# EAGLE design project_02 (EAGLE 9.6.2)
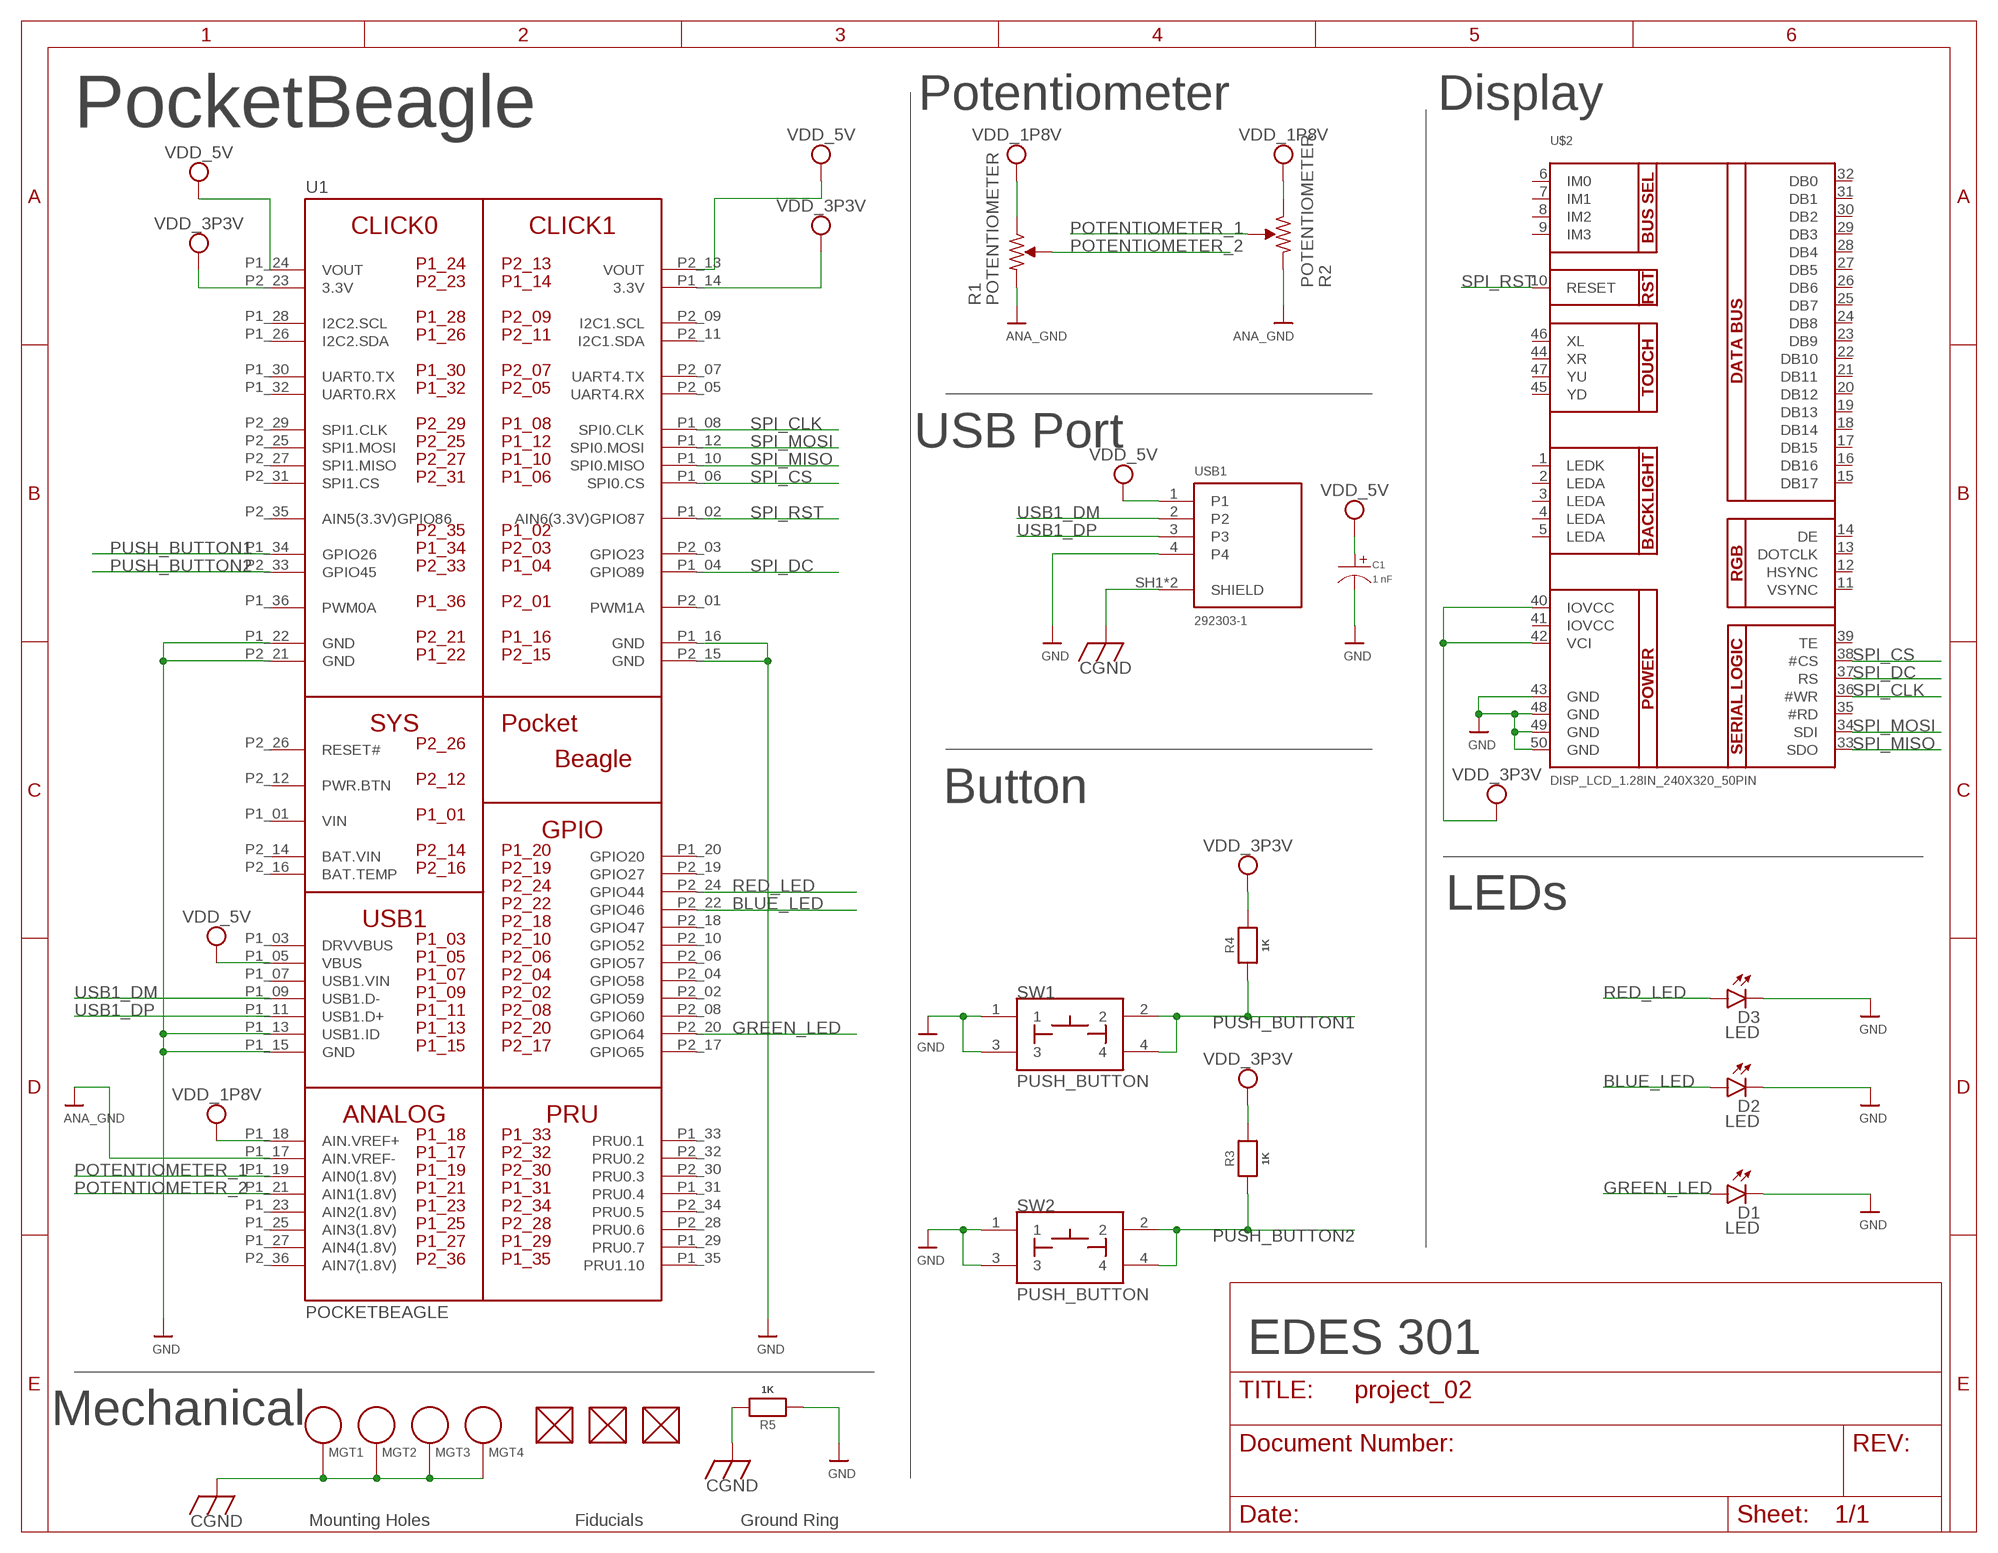
[diagram p0: schematic, sheet 1]

## Parts
C1  1 nF  CAPACITOR_P_4MM  [CP4MM]
D1  LED  LED_13MM  [LED3MM]
D2  LED  LED_13MM  [LED3MM]
D3  LED  LED_13MM  [LED3MM]
FUD2  FIDUCIAL  [FIDUCIAL_40MIL]
FUD3  FIDUCIAL  [FIDUCIAL_40MIL]
FUD4  FIDUCIAL  [FIDUCIAL_40MIL]
MGT1  MOUNTING_HOLE  [MOUNTING_HOLE]
MGT2  MOUNTING_HOLE  [MOUNTING_HOLE]
MGT3  MOUNTING_HOLE  [MOUNTING_HOLE]
MGT4  MOUNTING_HOLE  [MOUNTING_HOLE]
R1  POTENTIOMETER  [POT-PO90S]
R2  POTENTIOMETER  [POT-PO90S]
R3  1K  RESISTOR0603MINI  [0603-MINI]
R4  1K  RESISTOR0603MINI  [0603-MINI]
R5  1K  RESISTOR0603MINI  [0603-MINI]
SW1  PUSH_BUTTON  [BUTTON_12.5MM]
SW2  PUSH_BUTTON  [BUTTON_12.5MM]
U1  POCKETBEAGLE  [POCKETBEAGLE]
U$2  DISP_LCD_1.28IN_240X320_50PIN  [TFT_2.83IN_240X320_50PIN]
USB1  292303-1  [TE_292303-1]

## Nets
BLUE_LED: D2.A U1.P2_22(GPIO46)
CGND: MGT1.P$1 MGT2.P$1 MGT3.P$1 MGT4.P$1 R5.2 USB1.SH1(SHIELD) USB1.SH2(SHIELD)
GND: C1.P$2 D1.K(C) D2.K(C) D3.K(C) R1.CW R2.CW R5.1 SW1.1 SW1.3 SW2.1 SW2.3 U1.P1_13(USB1.ID) U1.P1_15(GND) U1.P1_16(GND) U1.P1_17(AIN.VREF-) U1.P1_22(GND) U1.P2_15(GND) U1.P2_21(GND) U$2.43(GND) U$2.48(GND) U$2.49(GND) U$2.50(GND) USB1.4 ; supply symbol labelled ANA_GND
GREEN_LED: D1.A U1.P2_20(GPIO64)
POTENTIOMETER_1: R2.S U1.P1_19(AIN0(1.8V))
POTENTIOMETER_2: R1.S U1.P1_21(AIN1(1.8V))
PUSH_BUTTON1: R4.1 SW1.2 SW1.4 U1.P1_34(GPIO26)
PUSH_BUTTON2: R3.1 SW2.2 SW2.4 U1.P2_33(GPIO45)
RED_LED: D3.A U1.P2_24(GPIO44)
SPI_CLK: U1.P1_08(SPI0.CLK) U$2.36(#WR)
SPI_CS: U1.P1_06(SPI0.CS) U$2.38(#CS)
SPI_DC: U1.P1_04(GPIO89) U$2.37(RS)
SPI_MISO: U1.P1_10(SPI0.MISO) U$2.33(SDO)
SPI_MOSI: U1.P1_12(SPI0.MOSI) U$2.34(SDI)
SPI_RST: U1.P1_02(AIN6(3.3V)GPIO87) U$2.10(RESET)
USB1_DM: U1.P1_09(USB1.D-) USB1.2
USB1_DP: U1.P1_11(USB1.D+) USB1.3
VDD_1P8V: R1.CCW R2.CCW U1.P1_18(AIN.VREF+)
VDD_3P3V: R3.2 R4.2 U1.P1_14(3.3V) U1.P2_23(3.3V) U$2.40(IOVCC) U$2.42(VCI)
VDD_5V: C1.P$1 U1.P1_05(VBUS) U1.P1_24(VOUT) U1.P2_13(VOUT) USB1.1
Unconnected: FUD2.P$1 FUD3.P$1 FUD4.P$1 U1.P1_03(DRVVBUS) U1.P1_07(USB1.VIN) U1.P1_20(GPIO20) U1.P1_23(AIN2(1.8V)) U1.P1_25(AIN3(1.8V)) U1.P1_26(I2C2.SDA) U1.P1_27(AIN4(1.8V)) U1.P1_28(I2C2.SCL) U1.P1_29(PRU0.7) U1.P1_30(UART0.TX) U1.P1_31(PRU0.4) U1.P1_32(UART0.RX) U1.P1_33(PRU0.1) U1.P1_35(PRU1.10) U1.P1_36(PWM0A) U1.P2_01(PWM1A) U1.P2_02(GPIO59) U1.P2_03(GPIO23) U1.P2_04(GPIO58) U1.P2_05(UART4.RX) U1.P2_06(GPIO57) U1.P2_07(UART4.TX) U1.P2_08(GPIO60) U1.P2_09(I2C1.SCL) U1.P2_10(GPIO52) U1.P2_11(I2C1.SDA) U1.P2_12(PWR.BTN) U1.P2_16(BAT.TEMP) U1.P2_17(GPIO65) U1.P2_18(GPIO47) U1.P2_19(GPIO27) U1.P2_25(SPI1.MOSI) U1.P2_26(RESET#) U1.P2_27(SPI1.MISO) U1.P2_28(PRU0.6) U1.P2_29(SPI1.CLK) U1.P2_30(PRU0.3) U1.P2_31(SPI1.CS) U1.P2_32(PRU0.2) U1.P2_34(PRU0.5) U1.P2_35(AIN5(3.3V)GPIO86) U1.P2_36(AIN7(1.8V)) U$2.1(LEDK) U$2.2(LEDA) U$2.3(LEDA) U$2.4(LEDA) U$2.5(LEDA) U$2.6(IM0) U$2.7(IM1) U$2.8(IM2) U$2.9(IM3) U$2.11(VSYNC) U$2.12(HSYNC) U$2.13(DOTCLK) U$2.14(DE) U$2.15(DB17) U$2.16(DB16) U$2.17(DB15) U$2.18(DB14) U$2.19(DB13) U$2.20(DB12) U$2.21(DB11) U$2.22(DB10) U$2.23(DB9) U$2.24(DB8) U$2.25(DB7) U$2.26(DB6) U$2.27(DB5) U$2.28(DB4) U$2.29(DB3) U$2.30(DB2) U$2.31(DB1) U$2.32(DB0) U$2.35(#RD) U$2.39(TE) U$2.41(IOVCC) U$2.44(XR) U$2.45(YD) U$2.46(XL) U$2.47(YU)

## Notes on the sheet
- Potentiometer | Display
- PocketBeagle
- USB Port
- Button
- LEDs
- EDES 301
- Mechanical
- Mounting Holes | Fiducials | Ground Ring

## Power pins joined to a net without a drawn wire
BAT.VIN: U1.P2_14(BAT.VIN)
VIN: U1.P1_01(VIN)

## Library data of the parts
C1 = MF_Passives:CAPACITOR_P: Library: MF_Passives Description: Device for Polarized Capacitors. Manufacture part number (MPN), Voltage Rating, and Tolerance can be added via Attributes. Check https://factory.macrofab.com/parts for the house parts list.; POPULATE: 1
D1-D3 = Adafruit 2.8 TFT Breakout v2:LED_1: LED OSRAM: - CHIPLED LG R971, LG N971, LY N971, LG Q971, LY Q971, LO R971, LY R971 LH N974, LH R974 LS Q976, LO Q976, LY Q976 LO Q996 - Hyper CHIPLED LW Q18S LB Q993, LB Q99A, LB R99A - SideLED LS A670, LO A670, LY A670, LG A670, LP A670 LB A673, LV A673, LT A673, LW A673 LH A674 LY A675 LS A676, LA A676, LO A676, LY A676, LW A676 LS A679, LY A679, LG A679 - Hyper Micro SIDELED® LS Y876, LA Y876, LO Y876, LY Y876 LT Y87S - SmartLED LW L88C, LW L88S LB L89C, LB L89S, LG L890 LS L89K, LO L89K, LY L89K LS L896, LA L896, LO L896, LY L896 - TOPLED LS T670, LO T670, LY T670, LG T670, LP T670 LSG T670, LSP T670, LSY T670, LOP T670, LYG T670 LG T671, LOG T671, LSG T671 LB T673, LV T673, LT T673, LW T673 LH T674 LS T676, LA T676, LO T676, LY T676, LB T676, LH T676, LSB T676, LW T676 LB T67C, LV T67C, LT T67C, LS T67K, LO T67K, LY T67K, LW E67C LS E67B, LA E67B, LO E67B, LY E67B, LB E67C, LV E67C, LT E67C LW T67C LS T679, LY T679, LG T679 LS T770, LO T770, LY T770, LG T770, LP T770 LB T773, LV T773, LT T773, LW T773 LH T774 LS E675, LA E675, LY E675, LS T675 LS T776, LA T776, LO T776, LY T776, LB T776 LHGB T686 LT T68C, LB T68C - Hyper Mini TOPLED® LB M676 - Mini TOPLED Santana® LG M470 LS M47K, LO M47K, LY M47K Source: http://www.osram.convergy.de LUXEON: - LUMILED® LXK2-PW12-R00, LXK2-PW12-S00, LXK2-PW14-U00, LXK2-PW14-V00 LXK2-PM12-R00, LXK2-PM12-S00, LXK2-PM14-U00 LXK2-PE12-Q00, LXK2-PE12-R00, LXK2-PE12-S00, LXK2-PE14-T00, LXK2-PE14-U00 LXK2-PB12-K00, LXK2-PB12-L00, LXK2-PB12-M00, LXK2-PB14-N00, LXK2-PB14-P00, LXK2-PB14-Q00 LXK2-PR12-L00, LXK2-PR12-M00, LXK2-PR14-Q00, LXK2-PR14-R00 LXK2-PD12-Q00, LXK2-PD12-R00, LXK2-PD12-S00 LXK2-PH12-R00, LXK2-PH12-S00 LXK2-PL12-P00, LXK2-PL12-Q00, LXK2-PL12-R00 Source: www.luxeon.com KINGBRIGHT: KA-3528ASYC Source: www.kingbright.com
FUD2-FUD4 = MISC:FIDUCIAL
MGT1-MGT4 = MISC:MOUNTING_HOLE: Chassis Mounting Hole w/GND connection ability
R1 R2 = Adafruit 2.8 TFT Breakout v2:POTENTIOMETER: Potentiometer - Examples: P090S-14T20BR10K (987-1277-ND)
R3-R5 = Adafruit 2.8 TFT Breakout v2:RESISTOR: Resistors For new designs, use the packages preceded by an '_' character since they are more reliable: The following footprints should be used on most boards: _0402 - Standard footprint for regular board layouts _0603 - Standard footprint for regular board layouts _0805 - Standard footprint for regular board layouts _1206 - Standard footprint for regular board layouts For extremely tight-pitch boards where space is at a premium, the following 'micro-pitch' footprints can be used (smaller pads, no silkscreen outline, etc.): _0402MP - Micro-pitch footprint for very dense/compact boards _0603MP - Micro-pitch footprint for very dense/compact boards _0805MP - Micro-pitch footprint for very dense/compact boards _1206MP - Micro-pitch footprint for very dense/compact boards
SW1 SW2 = Adafruit 2.8 TFT Breakout v2:PUSH_BUTTON
U1 = Adafruit 2.8 TFT Breakout v2:POCKETBEAGLE
U$2 = Adafruit 2.8 TFT Breakout v2:DISP_LCD_1.28IN_240X320_50PIN
USB1 = 292303-1:292303-1: Check availability <https://pricing.snapeda.com/parts/292303-1/TE%20Connectivity/view-part?ref=eda>; AVAILABILITY: In Stock; CENTERLINE_PITCH: 2 mm[.078 in]; CHECK_PRICES: https://www.snapeda.com/parts/292303-1/TE+Connectivity+AMP+Connectors/view-part/?ref=eda; COMMENT: 292303-1; DESCRIPTION: Type A Standard USB Connector 4 Position Right Angle Mount 1 Port | TE Connectivity 292303-1; EU_ROHS_COMPLIANCE: Compliant; MF: TE Connectivity; MP: 292303-1; NUMBER_OF_POSITIONS: 4; PACKAGE: None; PRICE: None; PRODUCT_TYPE: Connector; PURCHASE-URL: https://www.snapeda.com/api/url_track_click_mouser/?unipart_id=447501&manufacturer=TE Connectivity&part_name=292303-1&search_term=292303-1; SNAPEDA_LINK: https://www.snapeda.com/parts/292303-1/TE+Connectivity+AMP+Connectors/view-part/?ref=snap

## Board
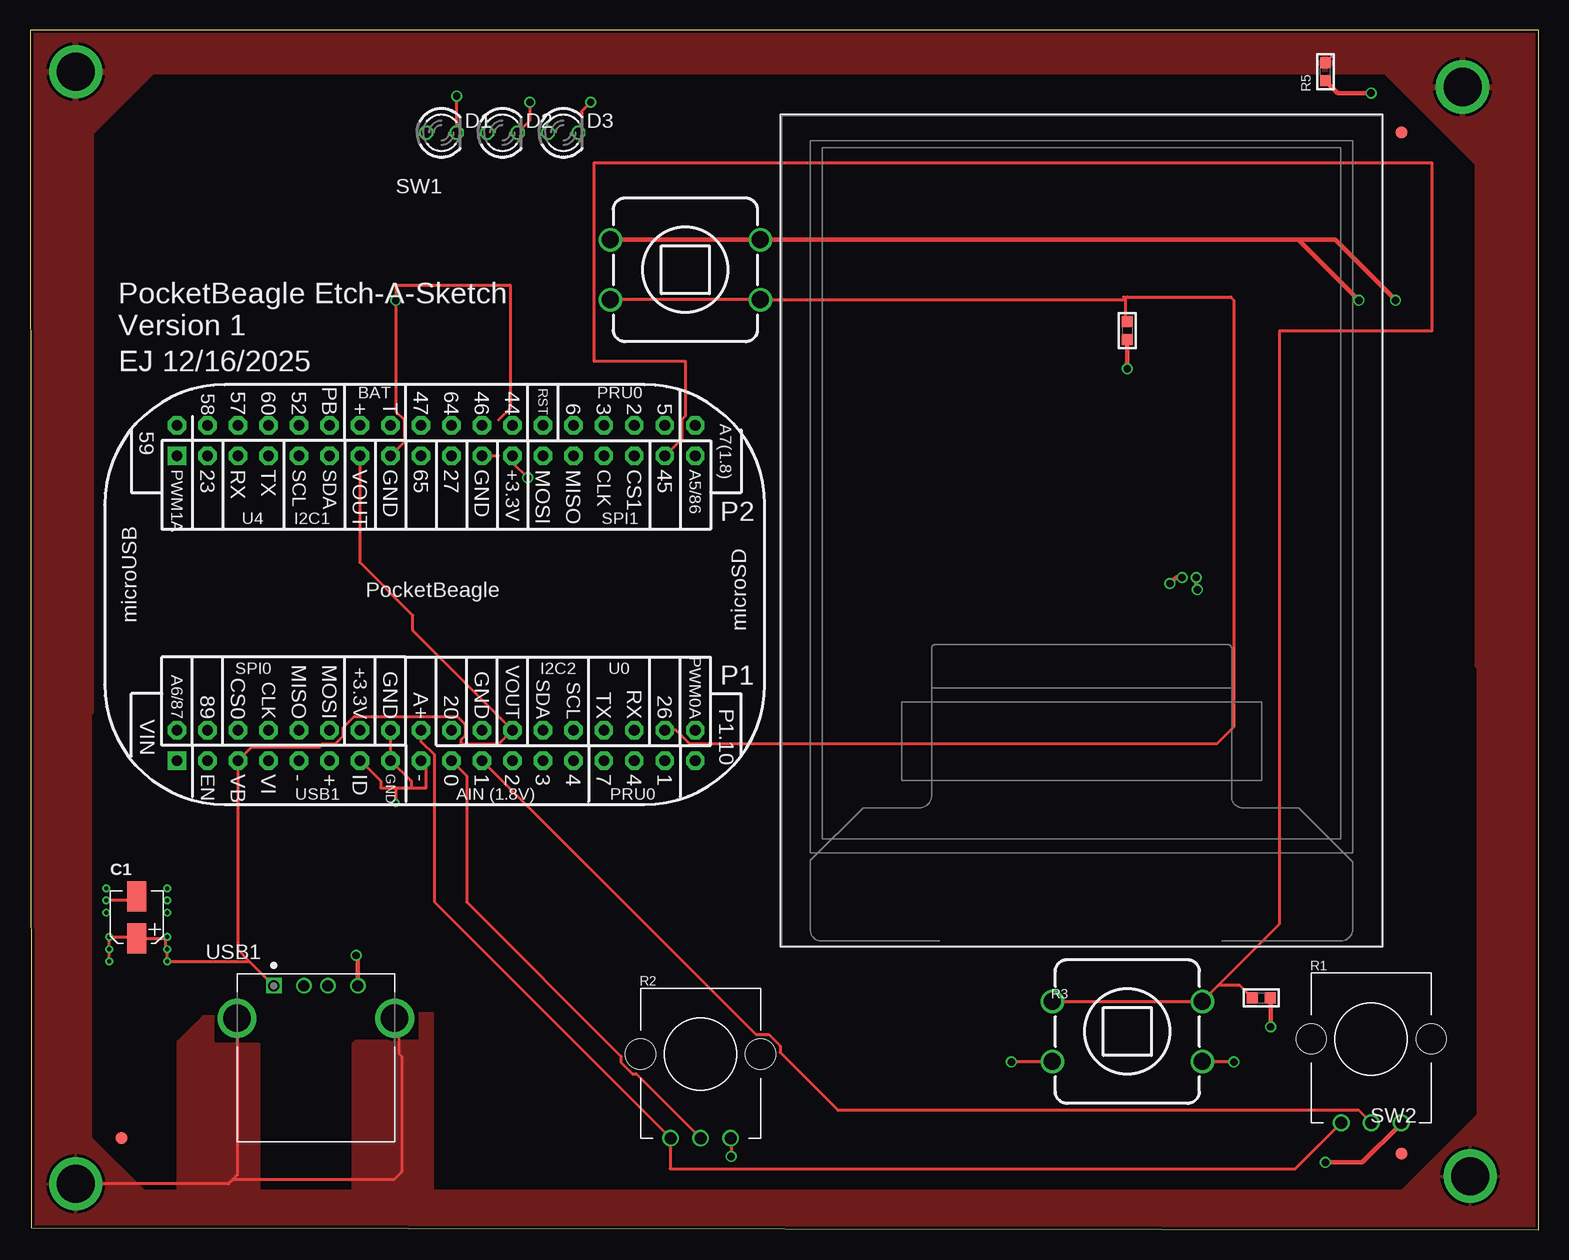
[diagram p1: board, top side]
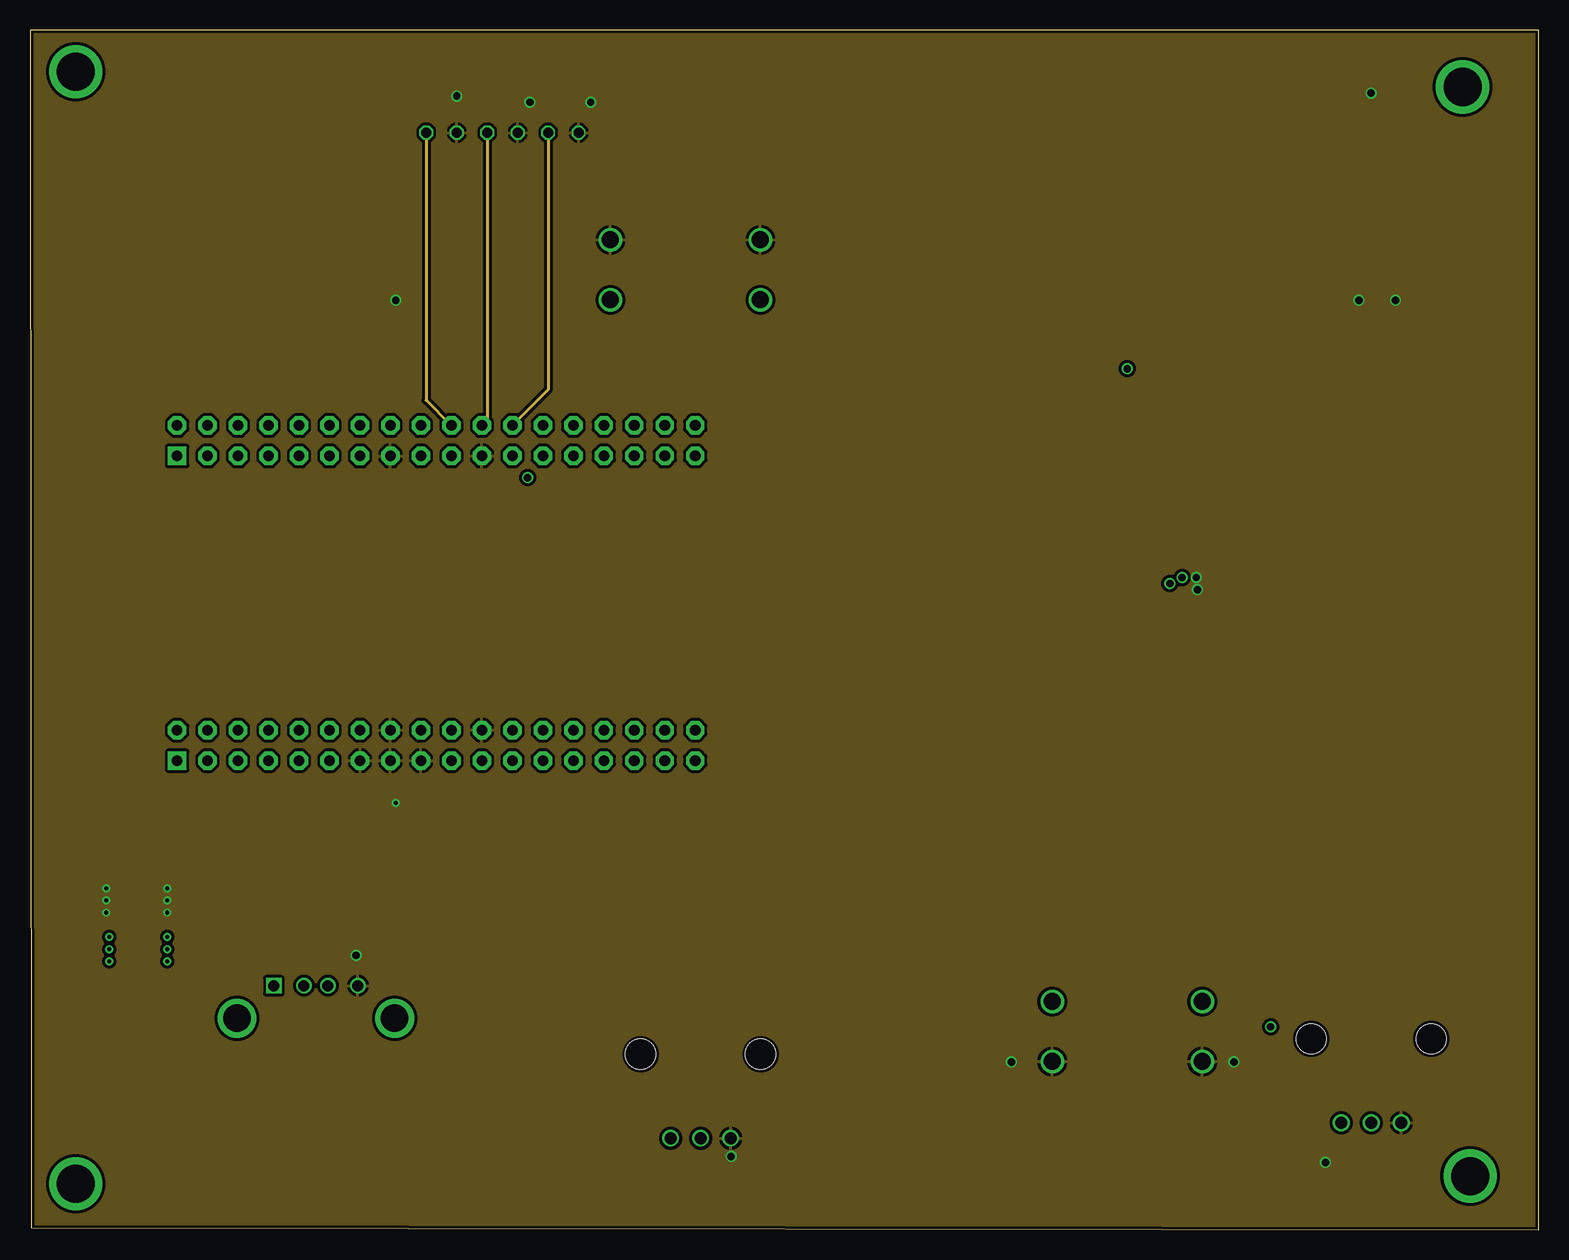
[diagram p2: board, inner layer Route2]
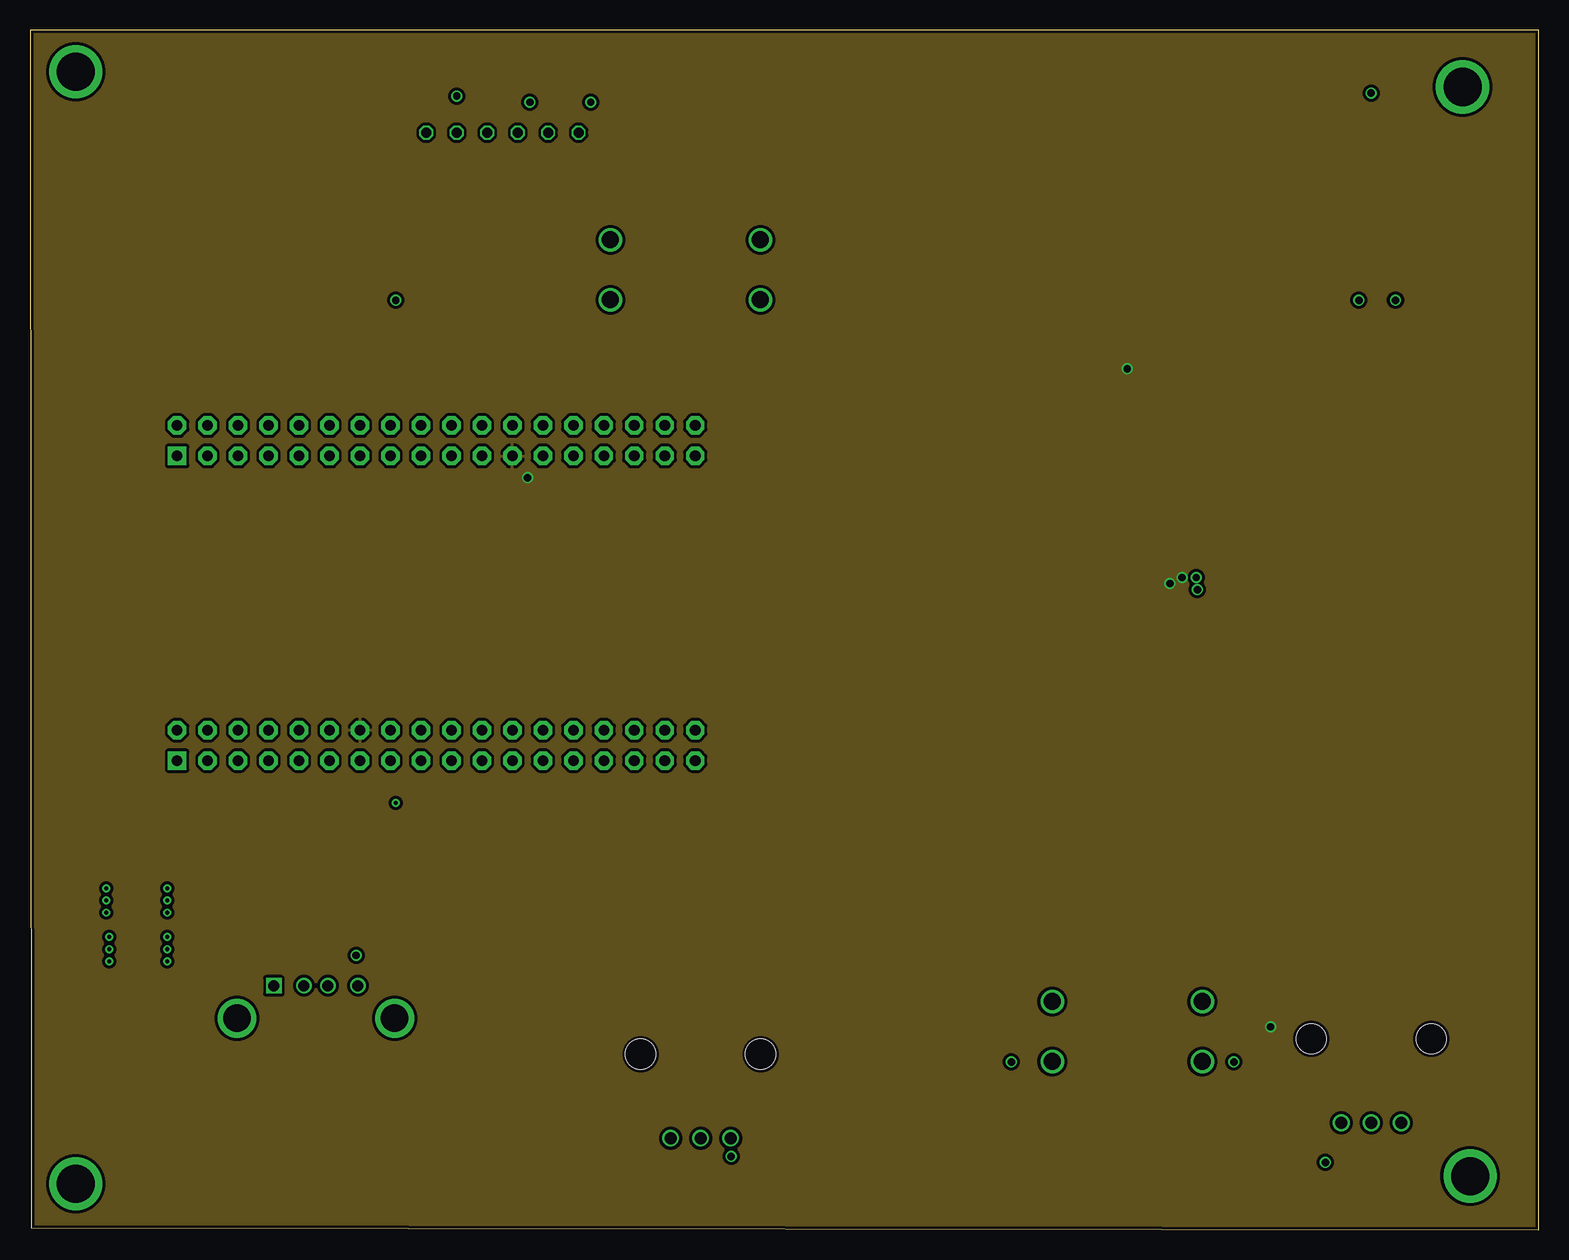
[diagram p3: board, inner layer Route15]
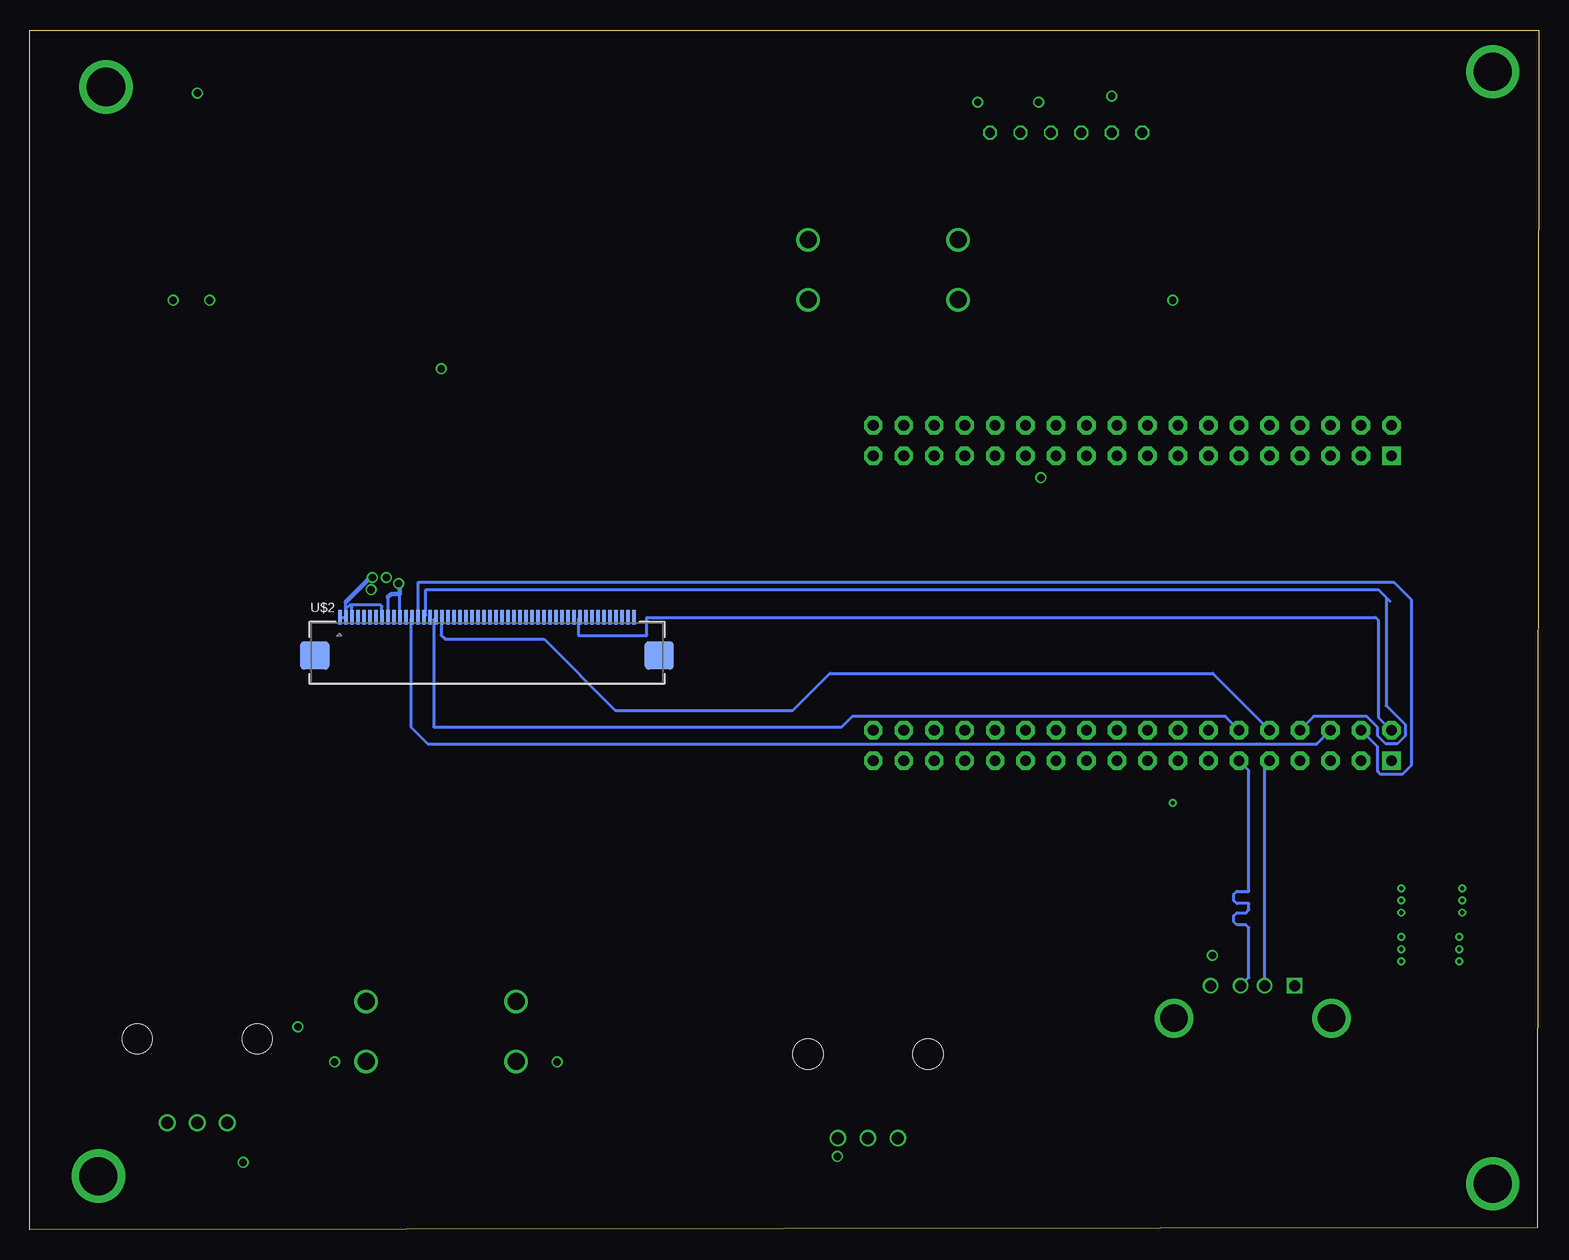
[diagram p4: board, bottom side, seen from below]

Size 125.71 x 100 mm. Coordinates in mm from the lower left corner, seen from the top.
Outline: 0.1,0.13 125.71,0 125.71,100 0,100 0.1,0.13
Copper layers (1*2*15*16): Top 0.035mm / dielectric 0.23mm / Route2 0.035mm / dielectric 0.93mm / Route15 0.035mm / dielectric 0.23mm / Bottom 0.035mm
Design rules "EDES301_4lyr": minimum track width 10mil, minimum drill 12mil, track to track 10mil, track to pad 10mil, pad to pad 10mil, via to via 10mil, smd to smd 10mil, copper to edge 10mil, drill to drill 12mil, minimum pad ring 6mil, minimum via ring 6mil, stop-mask expansion 3mil, vias tented up to drill 25mil, thermal gap 10mil

### Footprints (pad centres in the part's own frame; a part is rotated, then mirrored left to right if it is on the bottom)
CP4MM = smd 1.6 x 2.5: P$1 0,-1.75; P$2 0,1.75
LED3MM = drill 0.813 octagon: A -1.27,0; K 1.27,0
FIDUCIAL_40MIL = smd 1.016 x 1.016: P$1 0,0
MOUNTING_HOLE = drill 3.175 pad 4.445: P$1 0,0
POT-PO90S = drill 1: CCW -2.5,0; CW 2.5,0; S 0,0 | hole 2.5: -5,7; 5,7
0603-MINI = smd 0.9 x 0.9: 1 -0.75,0; 2 0.75,0
BUTTON_12.5MM = drill 1.4: 1 -6.25,2.5; 2 -6.25,-2.5; 3 6.25,2.5; 4 6.25,-2.5
POCKETBEAGLE = drill 0.889 pad 1.524 square: P1_01 5.91,3.53; P2_01 5.91,28.93 | drill 0.889 pad 1.524 octagon: P1_02 5.91,6.07; P1_03 8.45,3.53; P1_04 8.45,6.07; P1_05 10.99,3.53; P1_06 10.99,6.07; P1_07 13.53,3.53; P1_08 13.53,6.07; P1_09 16.07,3.53; P1_10 16.07,6.07; P1_11 18.61,3.53; P1_12 18.61,6.07; P1_13 21.15,3.53; P1_14 21.15,6.07; P1_15 23.69,3.53; P1_16 23.69,6.07; P1_17 26.23,3.53; P1_18 26.23,6.07; P1_19 28.77,3.53; P1_20 28.77,6.07; P1_21 31.31,3.53; P1_22 31.31,6.07; P1_23 33.85,3.53; P1_24 33.85,6.07; P1_25 36.39,3.53; P1_26 36.39,6.07; P1_27 38.93,3.53; P1_28 38.93,6.07; P1_29 41.47,3.53; P1_30 41.47,6.07; P1_31 44.01,3.53; P1_32 44.01,6.07; P1_33 46.55,3.53; P1_34 46.55,6.07; P1_35 49.09,3.53; P1_36 49.09,6.07; P2_02 5.91,31.47; P2_03 8.45,28.93; P2_04 8.45,31.47; P2_05 10.99,28.93; P2_06 10.99,31.47; P2_07 13.53,28.93; P2_08 13.53,31.47; P2_09 16.07,28.93; P2_10 16.07,31.47; P2_11 18.61,28.93; P2_12 18.61,31.47; P2_13 21.15,28.93; P2_14 21.15,31.47; P2_15 23.69,28.93; P2_16 23.69,31.47; P2_17 26.23,28.93; P2_18 26.23,31.47; P2_19 28.77,28.93; P2_20 28.77,31.47; P2_21 31.31,28.93; P2_22 31.31,31.47; P2_23 33.85,28.93; P2_24 33.85,31.47; P2_25 36.39,28.93; P2_26 36.39,31.47; P2_27 38.93,28.93; P2_28 38.93,31.47; P2_29 41.47,28.93; P2_30 41.47,31.47; P2_31 44.01,28.93; P2_32 44.01,31.47; P2_33 46.55,28.93; P2_34 46.55,31.47; P2_35 49.09,28.93; P2_36 49.09,31.47
TFT_2.83IN_240X320_50PIN = smd 0.275 x 1.2 bottom: 1 -12.25,-9.93; 2 -11.75,-9.93; 3 -11.25,-9.93; 4 -10.75,-9.93; 5 -10.25,-9.93; 6 -9.75,-9.93; 7 -9.25,-9.93; 8 -8.75,-9.93; 9 -8.25,-9.93; 10 -7.75,-9.93; 11 -7.25,-9.93; 12 -6.75,-9.93; 13 -6.25,-9.93; 14 -5.75,-9.93; 15 -5.25,-9.93; 16 -4.75,-9.93; 17 -4.25,-9.93; 18 -3.75,-9.93; 19 -3.25,-9.93; 20 -2.75,-9.93; 21 -2.25,-9.93; 22 -1.75,-9.93; 23 -1.25,-9.93; 24 -0.75,-9.93; 25 -0.25,-9.93; 26 0.25,-9.93; 27 0.75,-9.93; 28 1.25,-9.93; 29 1.75,-9.93; 30 2.25,-9.93; 31 2.75,-9.93; 32 3.25,-9.93; 33 3.75,-9.93; 34 4.25,-9.93; 35 4.75,-9.93; 36 5.25,-9.93; 37 5.75,-9.93; 38 6.25,-9.93; 39 6.75,-9.93; 40 7.25,-9.93; 41 7.75,-9.93; 42 8.25,-9.93; 43 8.75,-9.93; 44 9.25,-9.93; 45 9.75,-9.93; 46 10.25,-9.93; 47 10.75,-9.93; 48 11.25,-9.93; 49 11.75,-9.93; 50 12.25,-9.93 | smd 2.4 x 2.4 bottom: PAD1 14.35,-13.09; PAD2 -14.35,-13.09
TE_292303-1 = drill 0.92 square: 1 0,0 | drill 0.92: 2 2.5,0; 3 4.5,0; 4 7,0 | drill 2.3: SH1 -3.07,-2.71; SH2 10.07,-2.71

### Placement (x,y rotation side)
C1  8.89,26.04 0 top
D1  34.29,91.44 0 top
D2  39.37,91.44 0 top
D3  44.45,91.44 0 top
FUD2  7.62,7.62 270 top
FUD3  114.3,91.44 270 top
FUD4  114.3,6.35 270 top
MGT1  3.81,96.52 0 top
MGT2  3.81,3.81 90 top
MGT3  120.02,4.45 90 top
MGT4  119.38,95.25 90 top
R1  111.76,8.89 0 top
R2  55.88,7.62 0 top
R3  102.62,19.3 0 top
R4  91.44,74.93 270 top
R5  107.95,96.52 90 top
SW1  54.61,80.01 0 top
SW2  91.44,16.51 180 top
U1  6.35,35.56 0 top
U$2  87.63,60.96 0 top
USB1  20.32,20.32 0 top

### Tracks (layer width: path | path; a pad name or v marks a point on that pad's centre or on a via)
BLUE_LED
  Route2 0.254: D2.A 38.1,67.47 U1.P2_22
CGND
  Top 0.254: 2.34,5.03 3.56,3.81 MGT2.P$1 16.54,3.81 16.93,4.2 | R5.2 108.52,97.84 | MGT1.P$1 2.79,95.5 | USB1.SH1 17.27,17.59 17.27,4.55 16.93,4.2 | USB1.SH2 30.73,17.27 30.73,14.68 31.01,14.4 31.01,4.85 30.37,4.2 16.93,4.2
  pour Top: 5.08,43.18 -2.54,43.18 -2.54,105.41 125.73,105.41 125.73,46.99 120.65,46.99 120.65,88.9 113.03,96.52 10.16,96.52 5.08,91.44
  pour Top: 12.34,2.64 12.34,15.65 14.48,17.78 15.24,17.78 15.24,15.49 19.05,15.49 19.05,2.03 12.95,2.03
  pour Top: 26.92,2.79 26.92,15.49 27.18,15.75 32.26,15.75 32.51,15.49 32.51,18.03 33.53,18.03 33.53,1.78 34.04,1.27 28.45,1.27
  pour Top: -2.54,42.55 -2.54,-3.17 125.73,-3.17 125.73,46.35 125.09,46.99 120.65,46.99 120.65,9.53 120.02,8.89 114.3,3.17 9.53,3.17 5.08,7.62 5.08,43.18 -2.54,43.18
GND  (via drill 0.35, 0.61)
  Top 0.254: v41.66,93.98 41.66,92.46 D2.K | D3.K 45.97,91.69 45.97,93.22 v46.74,93.98 | 31.75,36.83 31.75,37.38 U1.P1_15 U1.P1_16 | 31.75,36.83 33.02,36.83 33.02,38.65 U1.P1_17 | U1.P1_13 29.21,37.38 29.21,36.83 30.48,36.83 | 30.48,36.83 31.75,36.83 | 30.48,36.83 v30.48,35.56 | 39.06,64.49 U1.P2_21 | D1.K v35.56,94.49 | R2.CW 58.42,7.58 v58.42,6.1 | SW2.3 85.15,13.97 v81.79,13.97 | SW2.1 100.29,14.01 v100.33,13.97 | U1.P2_15 31.18,65.63 31.18,67.5 30.48,68.21 v30.48,77.47 30.48,78.74 40.01,78.74 40.01,68.45 39.06,67.5 | C1.P$2 8.54,27.43 v6.35,27.43
  Top 0.381: USB1.4 27.32,22.72 v27.18,22.86 | R1.CW 114.26,8.81 111.04,5.59 v107.95,5.59 | v113.79,77.47 108.75,82.51 SW1.1 | v110.74,77.47 105.7,82.51 SW1.3 | v111.76,94.74 108.98,94.74 R5.1 | v97.18,54.36 97.18,53.44 v97.28,53.34
  Bottom 0.254: U$2.48 98.88,51.89 99.06,52.07 | 99.06,52.07 96.52,52.07 96.39,51.94 | 99.38,51.75 U$2.49 U$2.50 | 99.38,51.75 99.06,52.07 | U$2.43 96.38,51.93 96.39,51.94 | 96.39,51.94 96.39,51.93 | 99.38,51.75 99.38,52.32 99.38,52.39
  Bottom 0.381: 99.38,52.32 97.35,54.36 v97.18,54.36 97.03,54.36
  other vias: 6.35,28.45 6.35,26.42 11.43,28.45 11.43,27.43 11.43,26.42
  pour Route2: -5.08,107.95 128.27,107.95 128.27,-6.35 -5.08,-6.35 -5.08,-6.35
GREEN_LED
  Route2 0.254: D1.A 33.02,69.13 U1.P2_20
POTENTIOMETER_1
  Top 0.254: U1.P1_19 36.39,37.82 36.39,27.3 49.25,14.45 49.25,13.94 50.2,12.99 50.51,12.99 R2.S
POTENTIOMETER_2
  Top 0.254: R1.S 110.68,9.97 67.31,9.97 62.51,14.77 62.51,15.3 61.56,16.25 60.5,16.25 U1.P1_21
PUSH_BUTTON1
  Top 0.254: SW1.2 SW1.4 91.22,77.51 91.31,77.6 | 91.12,77.73 91.44,77.73 | 91.44,77.73 100.07,77.73 100.33,77.47 100.33,41.91 98.91,40.49 56.52,40.49 56.24,40.49 54.97,40.49 53.82,41.63 U1.P1_34 | 91.31,77.6 91.44,77.73 | R4.1 91.31,75.81 91.31,77.6
PUSH_BUTTON2
  Top 0.254: SW2.4 SW2.2 99.03,20.35 | 99.03,20.35 104.14,25.46 104.14,74.93 116.84,74.93 116.84,88.9 46.99,88.9 46.99,72.39 54.61,72.39 54.61,67.82 54.3,67.5 54.3,65.89 U1.P2_33 | R3.1 100.82,20.35 99.03,20.35
RED_LED
  Route2 0.254: D3.A 43.18,70.01 U1.P2_24
SPI_CLK
  Bottom 0.254: U$2.36 92.71,51.2 92.71,53.34 13.34,53.34 12.7,52.7 | 12.7,52.7 12.39,52.39 | U1.P1_08 18.74,42.77 14.33,42.77 13.4,41.85 13.4,41.16 12.73,40.49 11.79,40.49 11.12,41.16 11.12,42.1 12.7,43.69 12.7,52.7
SPI_CS
  Bottom 0.254: U$2.38 93.98,50.93 93.98,41.91 92.56,40.49 23.5,40.49 23.22,40.49 18.48,40.49 U1.P1_06
SPI_DC
  Bottom 0.254: U$2.37 93.34,51.06 93.34,53.98 12.06,53.98 10.61,52.52 10.61,38.68 11.34,37.95 13.18,37.95 13.4,38.17 13.4,40.23 U1.P1_04
SPI_MISO
  Bottom 0.254: U$2.33 91.44,50.97 91.44,49.53 91.12,49.21 82.87,49.21 76.94,43.28 62.13,43.28 59.05,46.35 27.14,46.35 U1.P1_10
SPI_MOSI
  Bottom 0.254: U$2.34 92.08,50.84 92.08,41.91 58.05,41.91 57.18,42.77 26.1,42.77 U1.P1_12
SPI_RST
  Bottom 0.254: U$2.10 80.01,50.9 80.01,49.53 74.3,49.53 74.3,51.03 13.56,51.03 13.34,50.8 13.34,42.7 U1.P1_02
USB1_DM
  Bottom 0.254: USB1.2 22.82,38.69 U1.P1_09
USB1_DP
  Bottom 0.254: USB1.3 24.13,21.01 24.13,25.15 24.38,25.4 25.15,25.4 25.4,25.65 25.4,26.16 25.15,26.42 24.38,26.42 24.13,26.67 24.13,27.18 25.15,27.18 25.4,27.43 25.4,27.94 25.15,28.19 24.13,28.19 24.13,38.26 U1.P1_11
VDD_1P8V
  Top 0.254: U1.P1_18 32.58,40.71 33.72,39.56 33.72,27.28 53.36,7.64 | R2.CCW 53.36,7.64 | R1.CCW 105.45,5.08 53.34,5.08 53.34,7.62 53.36,7.64
VDD_3P3V  (via drill 0.61)
  Top 0.254: U1.P2_23 40.2,63.94 v41.47,62.67
  Top 0.381: R4.2 v91.44,71.75 | R3.2 v103.38,16.89 | v95,53.85 95.5,54.36 v96.01,54.36
  Bottom 0.254: U$2.40 94.88,52.97 | 95.88,52.71 U$2.42
  Bottom 0.381: 95.88,52.71 95.62,52.97 94.88,52.97 94.88,53.73 v95,53.85
  pour Route15: -10.79,111.76 -10.79,-12.06 -10.16,-12.7 -9.53,-13.34 135.25,-13.34 135.25,111.76 132.08,114.94 -7.62,114.94
VDD_5V  (via drill 0.35)
  Top 0.254: USB1.1 18.29,22.35 | 18.29,22.35 17.34,23.3 U1.P1_05 18.48,40.23 24.13,40.23 24.38,40.49 25.43,40.49 26.1,41.16 26.1,41.85 27.03,42.77 35.59,42.77 36.26,42.1 36.26,41.16 35.92,40.81 35.92,40.49 39.06,40.49 U1.P1_24 31.9,49.93 31.9,51.2 27.5,55.6 U1.P2_13 | 18.29,22.35 v11.43,22.35 v11.43,23.37 11.33,23.47 11.33,24.29 | 11.33,24.29 C1.P$1 8.79,24.38 v6.6,24.38 v6.6,23.37 v6.6,22.35 | 11.33,24.29 v11.43,24.38

### Text on the board
tNames: PocketBeagle Etch-A-Sketch / Version 1 | EJ 12/16/2025